# Altium project Rev with streo jack.PrjPcb
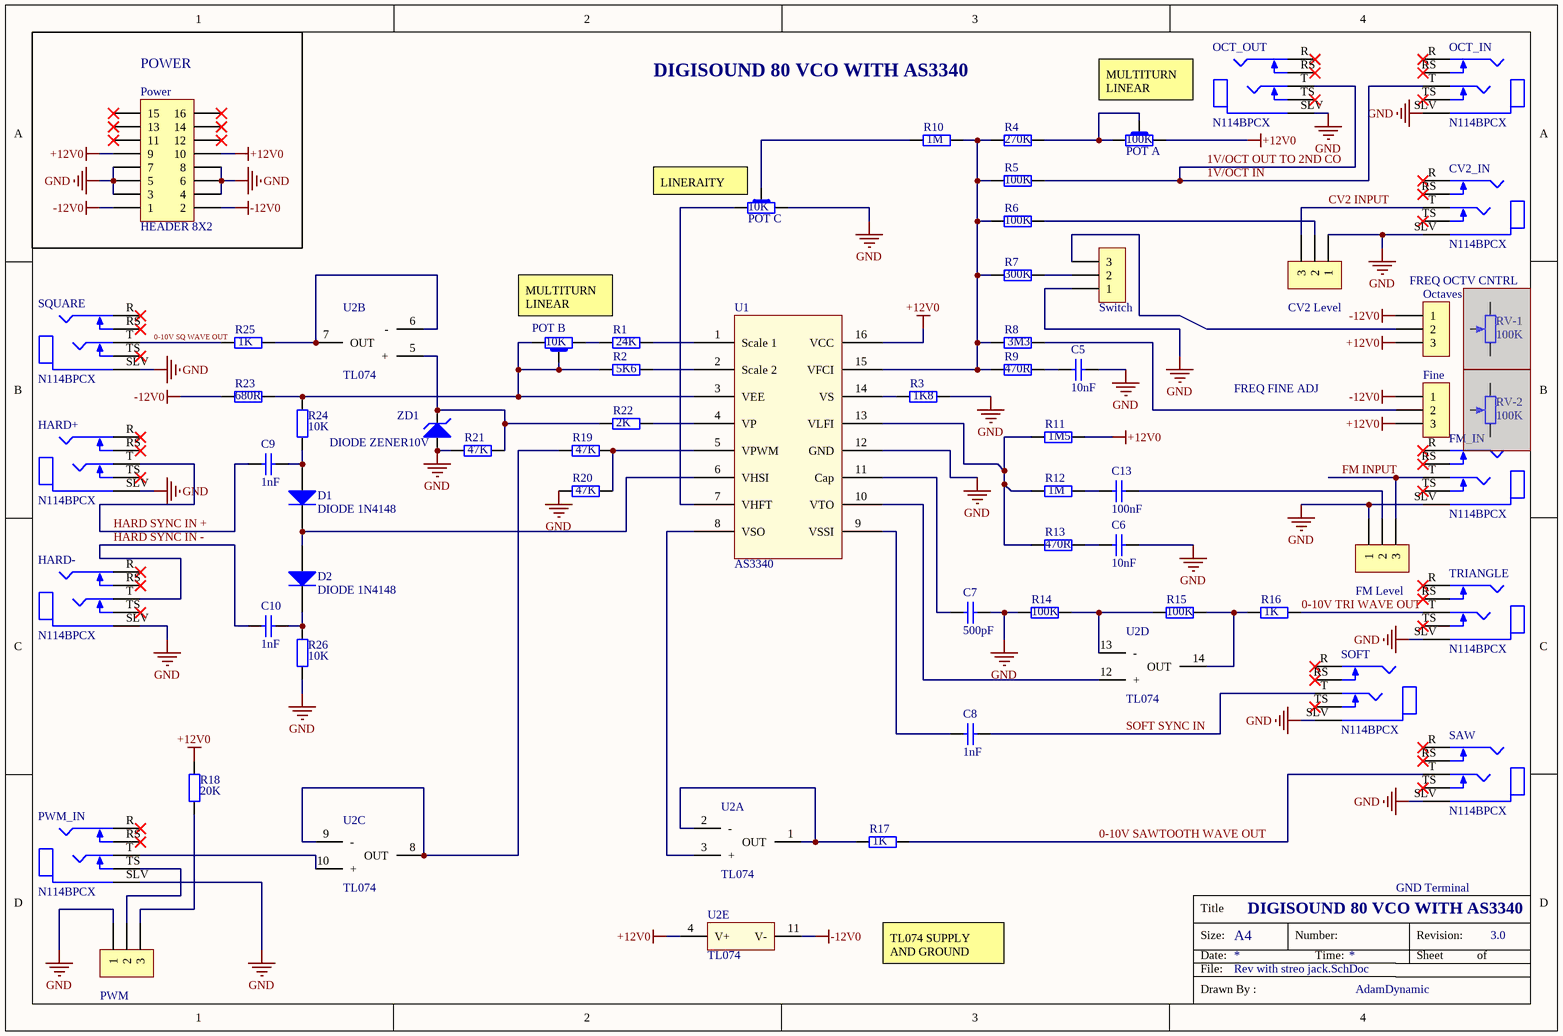
[diagram p0: Rev with streo jack.SchDoc]
1 sheet, 61 parts. Net scope: global (net labels, ports and power ports of the same name join across sheets).
Board file: Rev with streo jack.PcbDoc

## Sheet Rev with streo jack.SchDoc
size A4; Organization: Altium Limited; Address1: 3 Minna Close; Address2: Belrose; Address3: NSW 2085; Address4: Australia; DocumentNumber: 1; SheetNumber: 1; SheetTotal: 1

### Parts
C5  10nF
C6  10nF
C7  500pF
C8  1nF
C9  1nF
C10  1nF
C13  100nF
CV2_IN  N114BPCX  [SWITCHCRAFT_N114BPCX]
CV2_Level  SCREW TERMINAL 3WAY  [SCREW TERMINAL 3WAY]  (value not drawn)
D1  DIODE 1N4148  [DO-35]
D2  DIODE 1N4148  [DO-35]
Fine  SCREW TERMINAL 3WAY  [SCREW TERMINAL 3WAY]  (value not drawn)
FM_IN  N114BPCX  [SWITCHCRAFT_N114BPCX]
FM_Level  SCREW TERMINAL 3WAY  [SCREW TERMINAL 3WAY]  (value not drawn)
HARD+  N114BPCX  [SWITCHCRAFT_N114BPCX]
HARD-  N114BPCX  [SWITCHCRAFT_N114BPCX]
OCT_IN  N114BPCX  [SWITCHCRAFT_N114BPCX]
OCT_OUT  N114BPCX  [SWITCHCRAFT_N114BPCX]
Octaves  SCREW TERMINAL 3WAY  [SCREW TERMINAL 3WAY]  (value not drawn)
POT_A  100K  [RES VAR]
POT_B  10K  [RES VAR]
POT_C  10K  [RES VAR SQ]
Power  HEADER 8X2  [HEADER 8X2]
PWM  SCREW TERMINAL 3WAY  [SCREW TERMINAL 3WAY]  (value not drawn)
PWM_IN  N114BPCX  [SWITCHCRAFT_N114BPCX]
R1  24K  [RES 6.2 x 0.5 x 2.3]
R2  5K6  [RES 6.2 x 0.5 x 2.3]
R3  1K8  [RES 6.2 x 0.5 x 2.3]
R4  270K  [RES 6.2 x 0.5 x 2.3]
R5  100K  [RES 6.2 x 0.5 x 2.3]
R6  100K  [RES 6.2 x 0.5 x 2.3]
R7  300K  [RES 6.2 x 0.5 x 2.3]
R8  3M3  [RES 6.2 x 0.5 x 2.3]
R9  470R  [RES 6.2 x 0.5 x 2.3]
R10  1M  [RES 6.2 x 0.5 x 2.3]
R11  1M5  [RES 6.2 x 0.5 x 2.3]
R12  1M  [RES 6.2 x 0.5 x 2.3]
R13  470R  [RES 6.2 x 0.5 x 2.3]
R14  100K  [RES 6.2 x 0.5 x 2.3]
R15  100K  [RES 6.2 x 0.5 x 2.3]
R16  1K  [RES 6.2 x 0.5 x 2.3]
R17  1K  [RES 6.2 x 0.5 x 2.3]
R18  20K  [RES 6.2 x 0.5 x 2.3]
R19  47K  [RES 6.2 x 0.5 x 2.3]
R20  47K  [RES 6.2 x 0.5 x 2.3]
R21  47K  [RES 6.2 x 0.5 x 2.3]
R22  2K  [RES 6.2 x 0.5 x 2.3]
R23  680R  [RES 6.2 x 0.5 x 2.3]
R24  10K  [RES 6.2 x 0.5 x 2.3]
R25  1K  [RES 6.2 x 0.5 x 2.3]
R26  10K  [RES 6.2 x 0.5 x 2.3]
RV-1  value 100K  (hidden comment: ResPot)  (masked out: inside a compile mask, not in the netlist)
RV-2  value 100K  (hidden comment: ResPot)  (masked out: inside a compile mask, not in the netlist)
SAW  N114BPCX  [SWITCHCRAFT_N114BPCX]
SOFT  N114BPCX  [SWITCHCRAFT_N114BPCX]
SQUARE  N114BPCX  [SWITCHCRAFT_N114BPCX]
Switch  SCREW TERMINAL 3WAY  [SCREW TERMINAL 3WAY]  (value not drawn)
TRIANGLE  N114BPCX  [SWITCHCRAFT_N114BPCX]
U1  AS3340  [DIP 16 PIN]
U2  TL074  [DIP 14 PIN]  (parts A,B,C,D,E of 5)
ZD1  DIODE ZENER10V  [DO-41G]

### Blocks framed on the sheet
POWER: Power

### Nets
+12V0: Fine.3 Octaves.3 POT_A.1 Power.9 Power.10 R11.2 R18.2 U1.16(VCC) U2.4(V+)
-12V0: Fine.1 Octaves.1 Power.1 Power.2 R23.1 U2.11(V-)
GND: C5.1 C6.1 C7.1 CV2_IN.SLV(SLEEVE) CV2_Level.1 FM_IN.SLV(SLEEVE) FM_Level.1 HARD+.SLV(SLEEVE) HARD-.SLV(SLEEVE) OCT_IN.SLV(SLEEVE) OCT_OUT.SLV(SLEEVE) POT_C.3 Power.3 Power.4 Power.5 Power.6 Power.7 Power.8 PWM.1 PWM_IN.SLV(SLEEVE) R3.2 R14.1 R20.1 R21.1 R26.1 SAW.SLV(SLEEVE) SOFT.SLV(SLEEVE) SQUARE.SLV(SLEEVE) Switch.1 TRIANGLE.SLV(SLEEVE) U1.12(GND) ZD1.1(A)
0-10V SAWTOOTH WAVE OUT: R17.2 SAW.T(TIP)
0-10V SQ WAVE OUT: R25.1 SQUARE.T(TIP)
0-10V TRI WAVE OUT: R16.2 TRIANGLE.T(TIP)
1V/OCT IN: OCT_IN.T(TIP) OCT_OUT.T(TIP) R5.2  [also labelled 1V/OCT OUT TO 2ND CO]
CV2 INPUT: CV2_IN.T(TIP) CV2_Level.3
FM INPUT: FM_IN.T(TIP) FM_Level.3
HARD SYNC IN +: C9.2 HARD+.T(TIP)
HARD SYNC IN -: C10.2 HARD-.T(TIP)
SOFT SYNC IN: C8.1 SOFT.T(TIP)
NetC5_2: C5.2 R9.2
NetC6_2: C6.2 R13.2
NetC7_2: C7.2 U1.11(Cap)
NetC8_2: C8.2 U1.9(VSSI)
NetC9_1: C9.1 D1.1(A) R24.1
NetC10_1: C10.1 D2.2(K) R26.2
NetC13_1: C13.1 FM_Level.2
NetC13_2: C13.2 R12.2
NetCV2_Level_2: CV2_Level.2 R6.2
NetD1_2: D1.2(K) D2.1(A) U1.6(VHSI)
NetFine_2: Fine.2 R8.2
NetOctaves_2: Octaves.2 Switch.3
NetPOT_A_2: POT_A.2 POT_A.3 R4.2
NetPOT_B_1: POT_B.1 POT_B.2 R2.1 R23.2 R24.2 U1.3(VEE)
NetPOT_B_3: POT_B.3 R1.1
NetPOT_C_1: POT_C.1 U1.7(VHFT)
NetPOT_C_2: POT_C.2 R10.1
NetPWM_2: PWM.2 PWM_IN.TS(TIP_SHUNT)
NetPWM_3: PWM.3 R18.1
NetPWM_IN_T: PWM_IN.T(TIP) U2.10(+)
NetR1_2: R1.2 U1.1(Scale_1)
NetR2_2: R2.2 U1.2(Scale_2)
NetR3_1: R3.1 U1.14(VS)
NetR4_1: R4.1 R5.1 R6.1 R7.1 R8.1 R9.1 R10.2 U1.15(VFCI)
NetR7_2: R7.2 Switch.2
NetR11_1: R11.1 R12.1 R13.1 U1.13(VLFI)
NetR14_2: R14.2 R15.1 U2.13(-)
NetR15_2: R15.2 R16.1 U2.14(OUT)
NetR17_1: R17.1 U2.1(OUT) U2.2(-)
NetR19_1: R19.1 U2.8(OUT) U2.9(-)
NetR19_2: R19.2 R20.2 U1.5(VPWM)
NetR21_2: R21.2 R22.1 U2.5(+) ZD1.2(K)
NetR22_2: R22.2 U1.4(VP)
NetR25_2: R25.2 U2.6(-) U2.7(OUT)
NetU1_8: U1.8(VSO) U2.3(+)
NetU1_10: U1.10(VTO) U2.12(+)

Not connected (* = marked no-connect by the designer): CV2_IN R(RING)* RS(RING_SHUNT)* TS(TIP_SHUNT)*; FM_IN R(RING)* RS(RING_SHUNT)* TS(TIP_SHUNT)*; HARD+ R(RING)* RS(RING_SHUNT)* TS(TIP_SHUNT)*; HARD- R(RING)* RS(RING_SHUNT)* TS(TIP_SHUNT)*; OCT_IN R(RING)* RS(RING_SHUNT)* TS(TIP_SHUNT)*; OCT_OUT R(RING)* RS(RING_SHUNT)* TS(TIP_SHUNT)*; Power 11* 12* 13* 14* 15* 16*; PWM_IN R(RING)* RS(RING_SHUNT)*; SAW R(RING)* RS(RING_SHUNT)* TS(TIP_SHUNT)*; SOFT R(RING)* RS(RING_SHUNT)* TS(TIP_SHUNT)*; SQUARE R(RING)* RS(RING_SHUNT)* TS(TIP_SHUNT)*; TRIANGLE R(RING)* RS(RING_SHUNT)* TS(TIP_SHUNT)*

### Notes on the sheet
- DIGISOUND 80 VCO WITH AS3340
- (near POT_A) MULTITURN
  LINEAR
- (near POT_C) LINERAITY
- MULTITURN
  LINEAR
- FREQ OCTV CNTRL
- FREQ FINE ADJ
- GND Terminal
- TL074 SUPPLY AND GROUND
- 3.0
- AdamDynamic
- Title
- Size:
- Date:
- File:
- A4
- Number:
- Time:
- Revision:
- Sheet
- of
- Drawn By :

### Library data of the parts
C5-C10 C13 = CAP 1nF
  C5 C6: VALUE: 10nF
  C7: VALUE: 500pF
  C8-C10: VALUE: 1nF
  C13: VALUE: 100nF
CV2_IN FM_IN HARD+ HARD- OCT_IN OCT_OUT PWM_IN SAW SOFT SQUARE TRIANGLE = N114BPCX: Conn 1/4'' Phone Jack F 3 POS Solder ST Thru-Hole 5 Terminal 1 Port; Package: None; Price: None; Value: *; MP: N114BPCX; Availability: Unavailable
CV2_Level Fine FM_Level Octaves PWM Switch = SCREW TERMINAL 3WAY: SCREW TERMINAL 3WAY 5.08mm
D1 D2 = DIODE 1N4148: Small Signal Fast Switching Diodes
POT_A POT_B POT_C = ResTrimpot: Multiturn
  POT_A: Value: 100K
  POT_B POT_C: Value: 10K
R1-R26 = Res2: Resistor; Published: 8-Jun-2000; LatestRevisionDate: 17-Jul-2002; LatestRevisionNote: Re-released for DXP Platform.; PackageReference: AXIAL-0.4; Publisher: Altium Limited
  R1: Value: 24K
  R2: Value: 5K6
  R3: Value: 1K8
  R4: Value: 270K
  R5 R6 R14 R15: Value: 100K
  R7: Value: 300K
  R8: Value: 3M3
  R9 R13: Value: 470R
  R10 R12: Value: 1M
  R11: Value: 1M5
  R16 R17 R25: Value: 1K
  R18: Value: 20K
  R19-R21: Value: 47K
  R22: Value: 2K
  R23: Value: 680R
  R24 R26: Value: 10K
U1 = AS3340: Voltage Controlled Oscillator (VCO)
U2 = TL074: Low-Noise FET-Input Operational Amplifiers